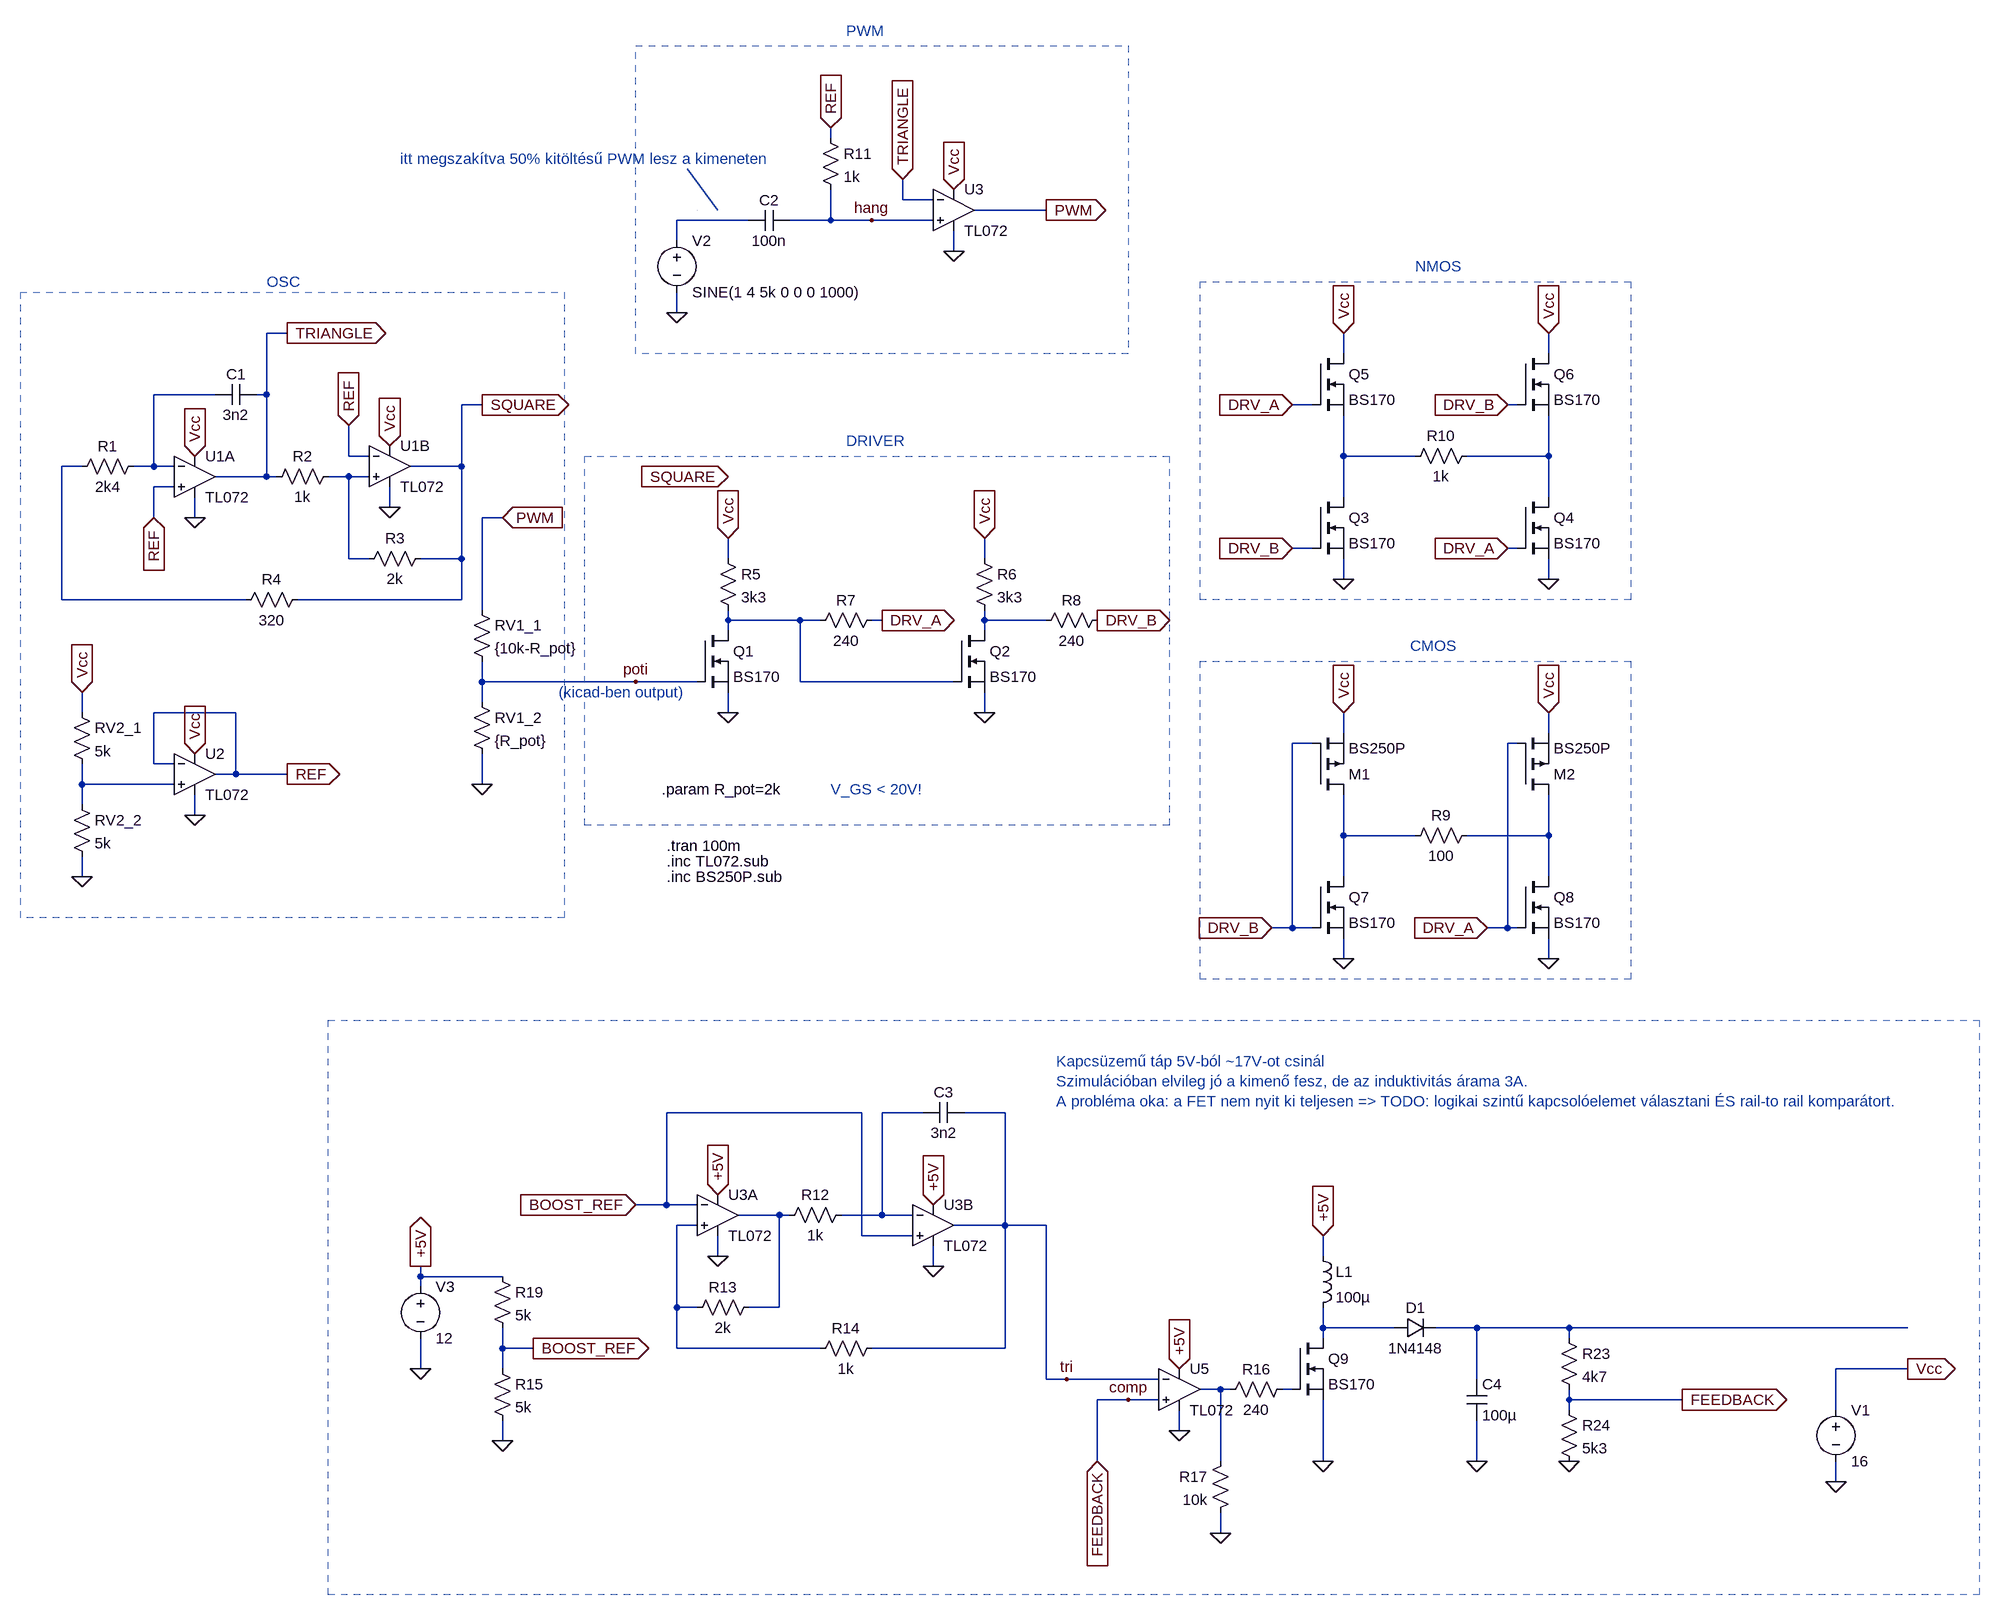
[diagram p0: schematic lebegteto_analog.asc]
lebegteto_analog.asc, the LTspice schematic file:
Version 4
SHEET 1 1512 1668
WIRE -480 -608 -480 -624
WIRE -368 -512 -368 -544
WIRE -320 -512 -368 -512
WIRE -144 -496 -256 -496
WIRE -608 -480 -720 -480
WIRE -480 -480 -480 -528
WIRE -480 -480 -544 -480
WIRE -416 -480 -480 -480
WIRE -320 -480 -416 -480
WIRE -720 -448 -720 -480
WIRE -288 -432 -288 -464
WIRE -720 -336 -720 -368
WIRE -1328 -304 -1360 -304
WIRE 320 -272 320 -304
WIRE 640 -272 640 -304
WIRE -1440 -208 -1536 -208
WIRE -1360 -208 -1360 -304
WIRE -1360 -208 -1376 -208
WIRE -1024 -192 -1056 -192
WIRE 272 -192 240 -192
WIRE 592 -192 576 -192
WIRE -1232 -112 -1232 -160
WIRE -1200 -112 -1232 -112
WIRE 320 -112 320 -176
WIRE 432 -112 320 -112
WIRE 640 -112 640 -176
WIRE 640 -112 512 -112
WIRE -1648 -96 -1680 -96
WIRE -1536 -96 -1536 -208
WIRE -1536 -96 -1568 -96
WIRE -1504 -96 -1536 -96
WIRE -1056 -96 -1056 -192
WIRE -1056 -96 -1136 -96
WIRE -1360 -80 -1360 -208
WIRE -1360 -80 -1440 -80
WIRE -1344 -80 -1360 -80
WIRE -1232 -80 -1264 -80
WIRE -1200 -80 -1232 -80
WIRE -1504 -64 -1536 -64
WIRE 320 -48 320 -112
WIRE 640 -48 640 -112
WIRE -1168 -32 -1168 -64
WIRE -1536 -16 -1536 -64
WIRE -1472 -16 -1472 -48
WIRE -992 -16 -1024 -16
WIRE 272 32 240 32
WIRE 592 32 576 32
WIRE -1232 48 -1232 -80
WIRE -1200 48 -1232 48
WIRE -1056 48 -1056 -96
WIRE -1056 48 -1120 48
WIRE -640 48 -640 16
WIRE -240 48 -240 16
WIRE 320 80 320 48
WIRE 640 80 640 48
WIRE -1680 112 -1680 -96
WIRE -1392 112 -1680 112
WIRE -1056 112 -1056 48
WIRE -1056 112 -1312 112
WIRE -1024 128 -1024 -16
WIRE -640 144 -640 128
WIRE -528 144 -640 144
WIRE -496 144 -528 144
WIRE -400 144 -416 144
WIRE -240 144 -240 128
WIRE -144 144 -240 144
WIRE -640 160 -640 144
WIRE -240 160 -240 144
WIRE -1024 240 -1024 208
WIRE -784 240 -1024 240
WIRE -688 240 -784 240
WIRE -528 240 -528 144
WIRE -288 240 -528 240
WIRE -1024 272 -1024 240
WIRE -1648 288 -1648 256
WIRE -1408 288 -1536 288
WIRE -640 288 -640 256
WIRE -240 288 -240 256
WIRE 320 320 320 288
WIRE 640 320 640 288
WIRE 272 336 240 336
WIRE 592 336 576 336
WIRE -1536 368 -1536 288
WIRE -1504 368 -1536 368
WIRE -1408 384 -1408 288
WIRE -1408 384 -1440 384
WIRE -1328 384 -1408 384
WIRE -1648 400 -1648 368
WIRE -1504 400 -1648 400
WIRE -1024 400 -1024 352
WIRE -1648 432 -1648 400
WIRE -1472 448 -1472 416
WIRE 320 480 320 416
WIRE 432 480 320 480
WIRE 640 480 640 416
WIRE 640 480 512 480
WIRE -1648 544 -1648 512
WIRE 320 544 320 480
WIRE 640 544 640 480
WIRE 240 624 240 336
WIRE 240 624 208 624
WIRE 272 624 240 624
WIRE 576 624 576 336
WIRE 576 624 544 624
WIRE 592 624 576 624
WIRE 320 672 320 640
WIRE 640 672 640 640
WIRE -432 912 -736 912
WIRE -336 912 -400 912
WIRE -208 912 -272 912
WIRE -736 1056 -736 912
WIRE -736 1056 -784 1056
WIRE -688 1056 -736 1056
WIRE -560 1072 -624 1072
WIRE -544 1072 -560 1072
WIRE -400 1072 -400 912
WIRE -400 1072 -464 1072
WIRE -352 1072 -400 1072
WIRE -688 1088 -720 1088
WIRE -208 1088 -208 912
WIRE -208 1088 -288 1088
WIRE -144 1088 -208 1088
WIRE -432 1104 -432 912
WIRE -352 1104 -432 1104
WIRE -656 1136 -656 1104
WIRE 288 1136 288 1104
WIRE -320 1152 -320 1120
WIRE -1120 1168 -1120 1152
WIRE -992 1168 -1120 1168
WIRE -1120 1184 -1120 1168
WIRE -720 1216 -720 1088
WIRE -688 1216 -720 1216
WIRE -560 1216 -560 1072
WIRE -560 1216 -608 1216
WIRE 288 1248 288 1216
WIRE 400 1248 288 1248
WIRE 528 1248 464 1248
WIRE 672 1248 528 1248
WIRE 1200 1248 672 1248
WIRE 288 1264 288 1248
WIRE 672 1264 672 1248
WIRE -992 1280 -992 1248
WIRE -944 1280 -992 1280
WIRE -720 1280 -720 1216
WIRE -496 1280 -720 1280
WIRE -208 1280 -208 1088
WIRE -208 1280 -416 1280
WIRE -1120 1312 -1120 1264
WIRE -992 1312 -992 1280
WIRE 1200 1312 1088 1312
WIRE -144 1328 -144 1088
WIRE -112 1328 -144 1328
WIRE 32 1328 -112 1328
WIRE 528 1328 528 1248
WIRE 128 1344 96 1344
WIRE 144 1344 128 1344
WIRE 240 1344 224 1344
WIRE -16 1360 -64 1360
WIRE 32 1360 -16 1360
WIRE 672 1360 672 1344
WIRE 848 1360 672 1360
WIRE 672 1376 672 1360
WIRE 1088 1376 1088 1312
WIRE 64 1408 64 1376
WIRE -992 1424 -992 1392
WIRE -64 1456 -64 1360
WIRE 128 1456 128 1344
WIRE 288 1456 288 1360
WIRE 528 1456 528 1392
WIRE 1088 1488 1088 1456
WIRE 128 1568 128 1536
FLAG -400 144 DRV_A
IOPIN -400 144 Out
FLAG -64 144 DRV_B
IOPIN -64 144 Out
FLAG -240 288 0
FLAG -640 288 0
FLAG -1168 -32 0
FLAG -1472 -16 0
FLAG -1024 400 0
FLAG 1088 1488 0
FLAG -1536 -16 REF
IOPIN -1536 -16 In
FLAG -1232 -160 REF
IOPIN -1232 -160 In
FLAG -1648 544 0
FLAG -1328 384 REF
IOPIN -1328 384 Out
FLAG -1328 -304 TRIANGLE
IOPIN -1328 -304 Out
FLAG 320 672 0
FLAG 640 672 0
FLAG 544 624 DRV_A
IOPIN 544 624 In
FLAG 208 624 DRV_B
IOPIN 208 624 In
FLAG -1648 256 Vcc
IOPIN -1648 256 In
FLAG -1168 -128 Vcc
IOPIN -1168 -128 In
FLAG -640 16 Vcc
IOPIN -640 16 In
FLAG -240 16 Vcc
IOPIN -240 16 In
FLAG 320 288 Vcc
IOPIN 320 288 In
FLAG 640 288 Vcc
IOPIN 640 288 In
FLAG -1472 -112 Vcc
IOPIN -1472 -112 In
FLAG 320 80 0
FLAG 640 80 0
FLAG 576 32 DRV_A
IOPIN 576 32 In
FLAG 240 32 DRV_B
IOPIN 240 32 In
FLAG 320 -304 Vcc
IOPIN 320 -304 In
FLAG 640 -304 Vcc
IOPIN 640 -304 In
FLAG 240 -192 DRV_A
IOPIN 240 -192 In
FLAG 576 -192 DRV_B
IOPIN 576 -192 In
FLAG -288 -432 0
FLAG -288 -528 Vcc
IOPIN -288 -528 In
FLAG -368 -544 TRIANGLE
IOPIN -368 -544 In
FLAG -720 -336 0
FLAG -144 -496 PWM
IOPIN -144 -496 Out
FLAG -1472 448 0
FLAG -1472 352 Vcc
IOPIN -1472 352 In
FLAG -1024 -192 SQUARE
IOPIN -1024 -192 Out
FLAG -480 -624 REF
IOPIN -480 -624 In
FLAG -640 -80 SQUARE
IOPIN -640 -80 In
FLAG -992 -16 PWM
IOPIN -992 -16 In
FLAG -656 1136 0
FLAG -656 1040 +5V
IOPIN -656 1040 In
FLAG -320 1152 0
FLAG -320 1056 +5V
IOPIN -320 1056 In
FLAG -1120 1312 0
FLAG -1120 1152 +5V
IOPIN -1120 1152 Out
FLAG 64 1408 0
FLAG 64 1312 +5V
IOPIN 64 1312 In
FLAG 288 1104 +5V
IOPIN 288 1104 In
FLAG 288 1456 0
FLAG 528 1456 0
FLAG 672 1456 0
FLAG 848 1360 FEEDBACK
IOPIN 848 1360 Out
FLAG 1200 1312 Vcc
IOPIN 1200 1312 Out
FLAG -16 1360 comp
FLAG -112 1328 tri
FLAG -992 1424 0
FLAG -944 1280 BOOST_REF
IOPIN -944 1280 Out
FLAG -784 1056 BOOST_REF
IOPIN -784 1056 In
FLAG -64 1456 FEEDBACK
IOPIN -64 1456 In
FLAG 128 1568 0
FLAG -784 240 poti
FLAG -416 -480 hang
SYMBOL res -400 128 R90
WINDOW 0 0 56 VBottom 2
WINDOW 3 32 56 VTop 2
SYMATTR InstName R7
SYMATTR Value 240
SYMBOL res -48 128 R90
WINDOW 0 0 56 VBottom 2
WINDOW 3 32 56 VTop 2
SYMATTR InstName R8
SYMATTR Value 240
SYMBOL nmos -688 160 R0
SYMATTR InstName Q1
SYMATTR Value BS170
SYMBOL res -656 32 R0
SYMATTR InstName R5
SYMATTR Value 3k3
SYMBOL nmos -288 160 R0
SYMATTR InstName Q2
SYMATTR Value BS170
SYMBOL res -256 32 R0
SYMATTR InstName R6
SYMATTR Value 3k3
SYMBOL OpAmps\\opamp2 -1168 -160 R0
SYMATTR InstName U1B
SYMATTR Value TL072
SYMBOL OpAmps\\opamp2 -1472 -144 R0
SYMATTR InstName U1A
SYMATTR Value TL072
SYMBOL res -1040 112 R0
SYMATTR InstName RV1_1
SYMATTR Value {10k-R_pot}
SYMBOL res -1040 256 R0
SYMATTR InstName RV1_2
SYMATTR Value {R_pot}
SYMBOL voltage 1088 1360 R0
WINDOW 123 0 0 Left 0
WINDOW 39 0 0 Left 0
SYMATTR InstName V1
SYMATTR Value 16
SYMBOL res -1104 32 R90
WINDOW 0 0 56 VBottom 2
WINDOW 3 32 56 VTop 2
SYMATTR InstName R3
SYMATTR Value 2k
SYMBOL res -1248 -96 R90
WINDOW 0 0 56 VBottom 2
WINDOW 3 32 56 VTop 2
SYMATTR InstName R2
SYMATTR Value 1k
SYMBOL cap -1376 -224 R90
WINDOW 0 0 32 VBottom 2
WINDOW 3 32 32 VTop 2
SYMATTR InstName C1
SYMATTR Value 3n2
SYMATTR SpiceLine IC=0.00001
SYMBOL res -1552 -112 R90
WINDOW 0 0 56 VBottom 2
WINDOW 3 32 56 VTop 2
SYMATTR InstName R1
SYMATTR Value 2k4
SYMBOL res -1296 96 R90
WINDOW 0 0 56 VBottom 2
WINDOW 3 32 56 VTop 2
SYMATTR InstName R4
SYMATTR Value 320
SYMBOL res -1664 272 R0
SYMATTR InstName RV2_1
SYMATTR Value 5k
SYMBOL res -1664 416 R0
SYMATTR InstName RV2_2
SYMATTR Value 5k
SYMBOL nmos 272 544 R0
SYMATTR InstName Q7
SYMATTR Value BS170
SYMBOL nmos 592 544 R0
SYMATTR InstName Q8
SYMATTR Value BS170
SYMBOL res 528 464 R90
WINDOW 0 0 56 VBottom 2
WINDOW 3 32 56 VTop 2
SYMATTR InstName R9
SYMATTR Value 100
SYMBOL pmos 272 416 M180
SYMATTR InstName M1
SYMATTR Value BS250P
SYMATTR Prefix X
SYMBOL pmos 592 416 M180
SYMATTR InstName M2
SYMATTR Value BS250P
SYMATTR Prefix X
SYMBOL nmos 272 -48 R0
SYMATTR InstName Q3
SYMATTR Value BS170
SYMBOL nmos 592 -48 R0
SYMATTR InstName Q4
SYMATTR Value BS170
SYMBOL res 528 -128 R90
WINDOW 0 0 56 VBottom 2
WINDOW 3 32 56 VTop 2
SYMATTR InstName R10
SYMATTR Value 1k
SYMBOL nmos 272 -272 R0
SYMATTR InstName Q5
SYMATTR Value BS170
SYMBOL nmos 592 -272 R0
SYMATTR InstName Q6
SYMATTR Value BS170
SYMBOL OpAmps\\opamp2 -288 -560 R0
SYMATTR InstName U3
SYMATTR Value TL072
SYMBOL voltage -720 -464 R0
WINDOW 123 0 0 Left 0
WINDOW 39 0 0 Left 0
SYMATTR InstName V2
SYMATTR Value SINE(1 4 5k 0 0 0 1000)
SYMBOL OpAmps\\opamp2 -1472 320 R0
SYMATTR InstName U2
SYMATTR Value TL072
SYMBOL cap -544 -496 R90
WINDOW 0 0 32 VBottom 2
WINDOW 3 32 32 VTop 2
SYMATTR InstName C2
SYMATTR Value 100n
SYMBOL res -496 -624 R0
SYMATTR InstName R11
SYMATTR Value 1k
SYMBOL OpAmps\\opamp2 -656 1008 R0
SYMATTR InstName U3A
SYMATTR Value TL072
SYMBOL OpAmps\\opamp2 -320 1024 R0
SYMATTR InstName U3B
SYMATTR Value TL072
SYMBOL res -448 1056 R90
WINDOW 0 0 56 VBottom 2
WINDOW 3 32 56 VTop 2
SYMATTR InstName R12
SYMATTR Value 1k
SYMBOL res -592 1200 R90
WINDOW 0 0 56 VBottom 2
WINDOW 3 32 56 VTop 2
SYMATTR InstName R13
SYMATTR Value 2k
SYMBOL res -400 1264 R90
WINDOW 0 0 56 VBottom 2
WINDOW 3 32 56 VTop 2
SYMATTR InstName R14
SYMATTR Value 1k
SYMBOL cap -272 896 R90
WINDOW 0 0 32 VBottom 2
WINDOW 3 32 32 VTop 2
SYMATTR InstName C3
SYMATTR Value 3n2
SYMATTR SpiceLine IC=0.00001
SYMBOL voltage -1120 1168 R0
SYMATTR InstName V3
SYMATTR Value 12
SYMBOL OpAmps\\opamp2 64 1280 R0
SYMATTR InstName U5
SYMATTR Value TL072
SYMBOL nmos 240 1264 R0
SYMATTR InstName Q9
SYMATTR Value BS170
SYMBOL ind 272 1120 R0
SYMATTR InstName L1
SYMATTR Value 100µ
SYMBOL diode 400 1264 R270
WINDOW 0 32 32 VTop 2
WINDOW 3 0 32 VBottom 2
SYMATTR InstName D1
SYMATTR Value 1N4148
SYMBOL cap 512 1328 R0
SYMATTR InstName C4
SYMATTR Value 100µ
SYMBOL res 656 1248 R0
SYMATTR InstName R23
SYMATTR Value 4k7
SYMBOL res 656 1360 R0
SYMATTR InstName R24
SYMATTR Value 5k3
SYMBOL res -1008 1152 R0
SYMATTR InstName R19
SYMATTR Value 5k
SYMBOL res -1008 1296 R0
SYMATTR InstName R15
SYMATTR Value 5k
SYMBOL res 240 1328 R90
WINDOW 0 0 56 VBottom 2
WINDOW 3 32 56 VTop 2
SYMATTR InstName R16
SYMATTR Value 240
SYMBOL res 144 1440 M0
SYMATTR InstName R17
SYMATTR Value 10k
TEXT -736 520 Left 2 !.inc TL072.sub
TEXT -736 496 Left 2 !.tran 100m
TEXT -736 544 Left 2 !.inc BS250P.sub
TEXT 432 -408 Left 2 ;NMOS
TEXT 424 184 Left 2 ;CMOS
TEXT -456 -136 Left 2 ;DRIVER
TEXT -1360 -384 Left 2 ;OSC
TEXT -480 408 Left 2 ;V_GS < 20V!
TEXT -456 -776 Left 2 ;PWM
TEXT -744 408 Left 2 !.param R_pot=2k
TEXT -1152 -576 Left 2 ;itt megszakítva 50% kitöltésű PWM lesz a kimeneten
TEXT -904 256 Left 2 ;(kicad-ben output)
TEXT -128 832 Left 2 ;Kapcsüzemű táp 5V-ból ~17V-ot csinál\nSzimulációban elvileg jó a kimenő fesz, de az induktivitás árama 3A.\nA probléma oka: a FET nem nyit ki teljesen => TODO: logikai szintű kapcsolóelemet választani ÉS rail-to rail komparátort.
LINE Normal -656 -496 -704 -560
LINE Normal -688 -496 -688 -496 2
LINE Normal -688 -496 -688 -496 2
RECTANGLE Normal 768 112 96 -384 2
RECTANGLE Normal 768 704 96 208 2
RECTANGLE Normal -896 608 -1744 -368 2
RECTANGLE Normal 48 464 -864 -112 2
RECTANGLE Normal -16 -272 -784 -752 2
RECTANGLE Normal 1312 1664 -1264 768 2

The netlist it stands for:
* lebegteto_analog.asc
R7 DRV_A N007 240
R8 DRV_B N008 240
M§Q1 N007 poti 0 0 BS170
R5 Vcc N007 3k3
M§Q2 N008 N007 0 0 BS170
R6 Vcc N008 3k3
XU1B N006 REF Vcc 0 SQUARE TL072  ; pins In+ In- V+ V- OUT
XU1A REF N002 Vcc 0 TRIANGLE TL072  ; pins In+ In- V+ V- OUT
RV1_1 PWM poti {10k-R_pot}
RV1_2 poti 0 {R_pot}
V1 Vcc 0 16
R3 SQUARE N006 2k
R2 N006 TRIANGLE 1k
C1 TRIANGLE N002 3n2 IC=0.00001
R1 N002 N005 2k4
R4 SQUARE N005 320
RV2_1 Vcc N009 5k
RV2_2 N009 0 5k
M§Q7 N010 DRV_B 0 0 BS170
M§Q8 N011 DRV_A 0 0 BS170
R9 N011 N010 100
XM1 N010 DRV_B Vcc BS250P  ; pins D G S
XM2 N011 DRV_A Vcc BS250P  ; pins D G S
M§Q3 N003 DRV_B 0 0 BS170
M§Q4 N004 DRV_A 0 0 BS170
R10 N004 N003 1k
M§Q5 Vcc DRV_A N003 N003 BS170
M§Q6 Vcc DRV_B N004 N004 BS170
XU3 hang TRIANGLE Vcc 0 PWM TL072  ; pins In+ In- V+ V- OUT
V2 N001 0 SINE(1 4 5k 0 0 0 1000)
XU2 N009 REF Vcc 0 REF TL072  ; pins In+ In- V+ V- OUT
C2 hang N001 100n
R11 REF hang 1k
XU3A N014 BOOST_REF +5V 0 N013 TL072  ; pins In+ In- V+ V- OUT
XU3B BOOST_REF N012 +5V 0 tri TL072  ; pins In+ In- V+ V- OUT
R12 N012 N013 1k
R13 N013 N014 2k
R14 tri N014 1k
C3 tri N012 3n2 IC=0.00001
V3 +5V 0 12
XU5 comp tri +5V 0 N017 TL072  ; pins In+ In- V+ V- OUT
M§Q9 N015 N018 0 0 BS170
L1 +5V N015 100µ
D1 N015 N016 1N4148
C4 N016 0 100µ
R23 N016 comp 4k7
R24 comp 0 5k3
R19 +5V BOOST_REF 5k
R15 BOOST_REF 0 5k
R16 N018 N017 240
R17 N017 0 10k
.model D D
.lib standard.dio
.model NMOS NMOS
.model PMOS PMOS
.lib standard.mos
.inc TL072.sub
.tran 100m
.inc BS250P.sub
* NMOS
* CMOS
* DRIVER
* OSC
* V_GS < 20V!
* PWM
.param R_pot=2k
* itt megszakítva 50% kitöltésű PWM lesz a kimeneten
* (kicad-ben output)
* Kapcsüzemű táp 5V-ból ~17V-ot csinál
* Szimulációban elvileg jó a kimenő fesz, de az induktivitás árama 3A.
* A probléma oka: a FET nem nyit ki teljesen => TODO: logikai szintű kapcsolóelemet választani ÉS rail-to rail komparátort.
.backanno
.end